# EAGLE schematic Kinefox_3 (EAGLE 9.6.2)
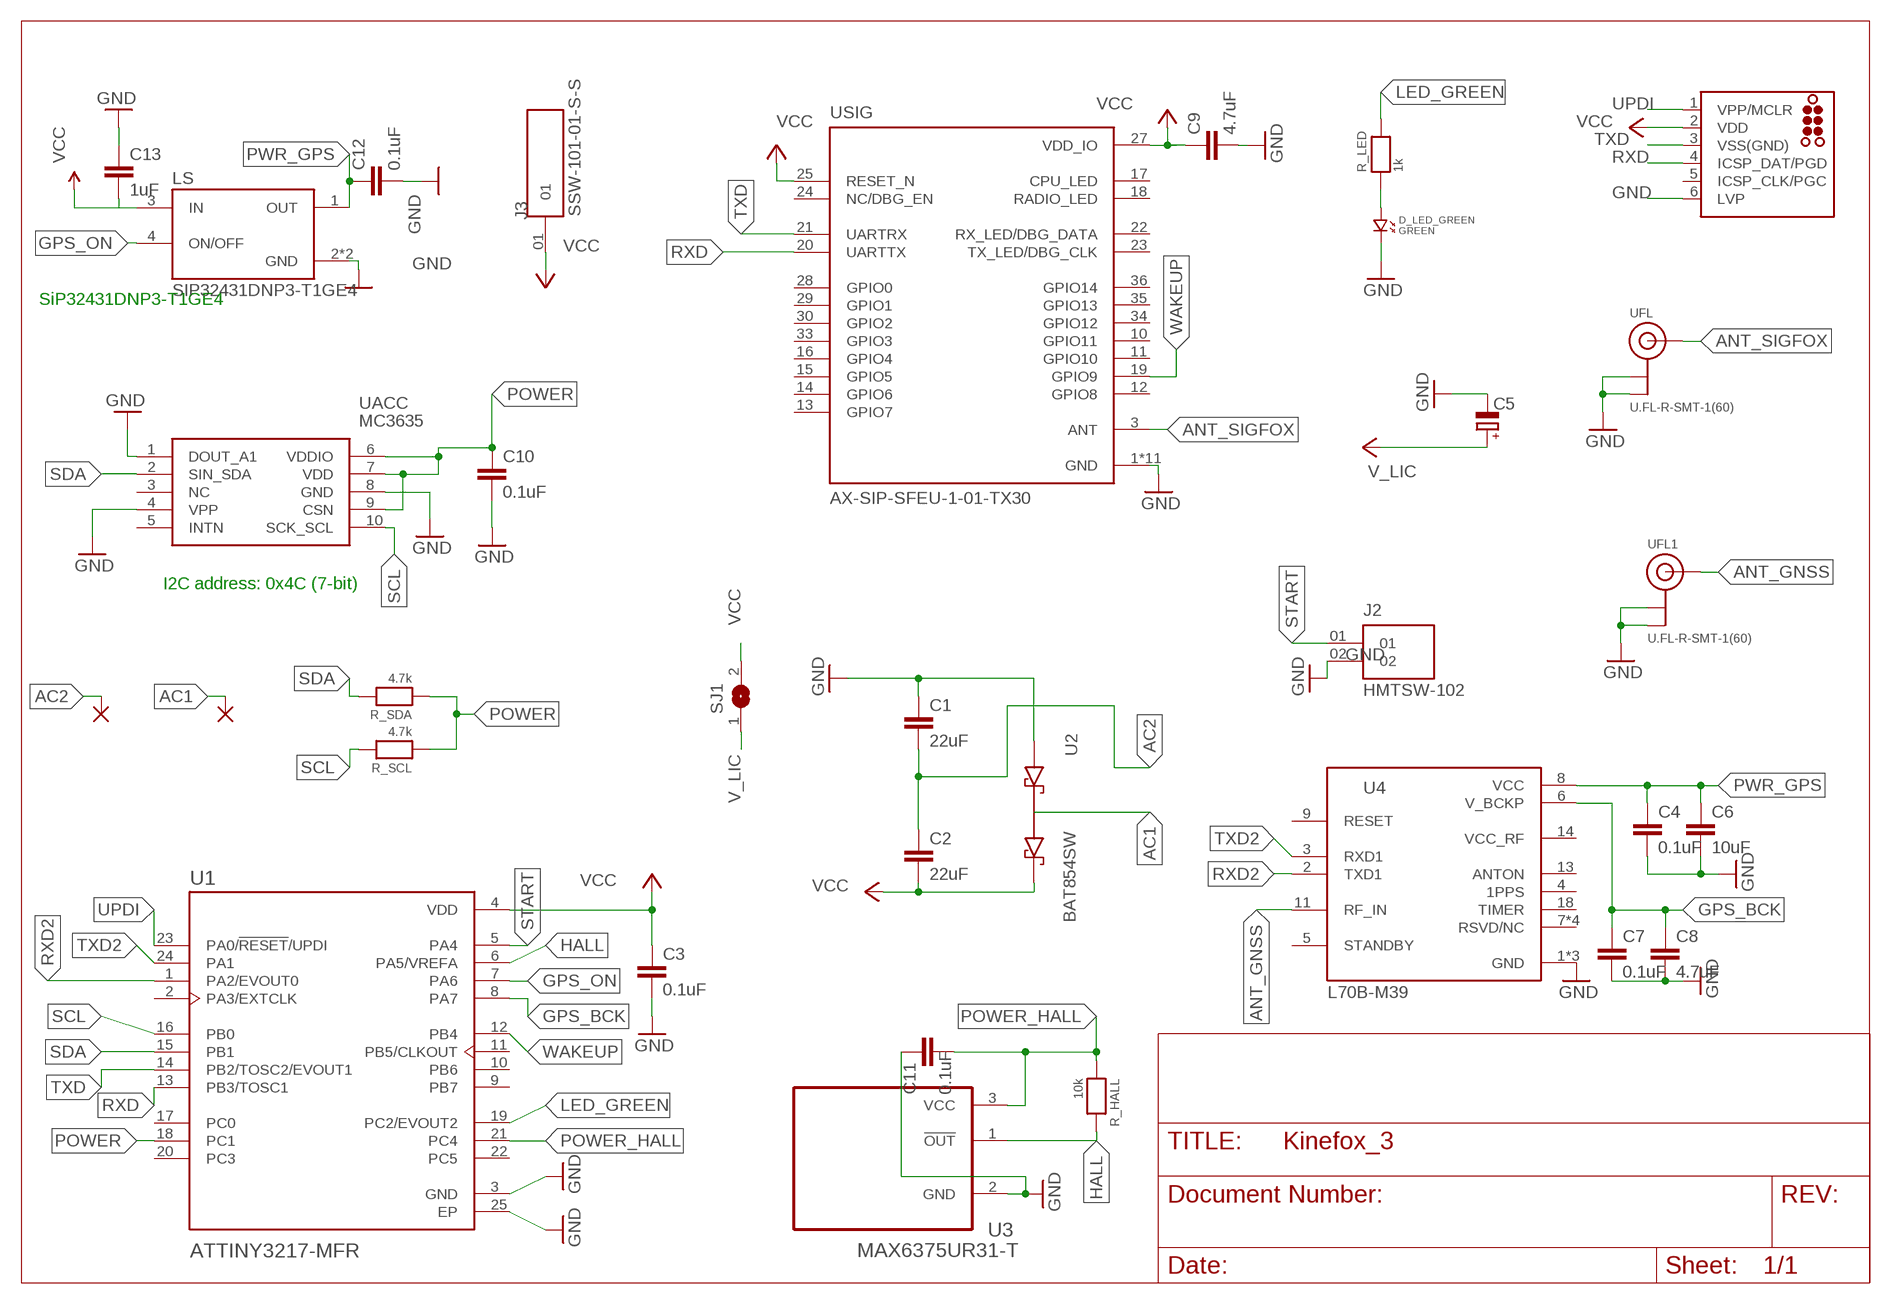
[diagram p0: schematic, sheet 1]

## Parts
C1  22uF  C0402_8PF  [C0402]
C2  22uF  C0402_8PF  [C0402]
C3  0.1uF  C0402_8PF  [C0402]
C4  0.1uF  C0402_8PF  [C0402]
C5  CPOL-EUE3.5-8  [E3,5-8]
C6  10uF  C0402_8PF  [C0402]
C7  0.1uF  C0402_8PF  [C0402]
C8  4.7uF  C0402_8PF  [C0402]
C9  4.7uF  C0402_8PF  [C0402]
C10  0.1uF  C0402_8PF  [C0402]
C11  0.1uF  C0402_8PF  [C0402]
C12  0.1uF  C0402_8PF  [C0402]
C13  1uF  C0402_8PF  [C0402]
D_LED_GREEN  GREEN  CMONR_STANDARDPARTS_LED.0402  [CMONR_STANDARDPARTS_0402.LED]
J1  TC2030-MCP-NL  [TC2030-MCP-NL]
J2  HMTSW-102  HMTSW-102-XX-X-S-XXX  [SAMTEC_HMTSW-102-XX-X-S-XXX]
J3  SSW-101-01-S-S  [SAMTEC_SSW-101-01-S-S]
LS  SIP32431DNP3-T1GE4  [SON50P120X160X60-5N]
PAD1  WIREPAD2,54/1,1  [2,54/1,1]
PAD2  WIREPAD2,54/1,1  [2,54/1,1]
R_HALL  10k  MICROBUILDER_RESISTOR_0402  [MICROBUILDER__0402]
R_LED  1k  MICROBUILDER_RESISTOR_0402  [MICROBUILDER__0402]
R_SCL  4.7k  MICROBUILDER_RESISTOR_0402  [MICROBUILDER__0402]
R_SDA  4.7k  MICROBUILDER_RESISTOR_0402  [MICROBUILDER__0402]
SJ1  SJ  [SJ]
U1  ATTINY3217-MFR  [QFN50P400X400X90-25N]
U2  BAT854SW  [SOT323]
U3  MAX6375UR31-T  [SOT95P237X112-3N]
U4  L70B-M39  [XCVR_L70B-M39]
UACC  MC3635  [MC3635]
UFL  U.FL-R-SMT-1(60)  ANTENNA_U.FL  [U.FL]
UFL1  U.FL-R-SMT-1(60)  ANTENNA_U.FL  [U.FL]
USIG  AX-SIP-SFEU-1-01-TX30  [IC_AX-SIP-SFEU-1-01-TX30]

## Nets
AC1: PAD1.1(P) U2.1(PIN3)
AC2: C1.2 C2.1 PAD2.1(P)
ANT_GNSS: U4.11(RF_IN) UFL1.3(SIGNAL)
ANT_SIGFOX: UFL.3(SIGNAL) USIG.3(ANT)
GND: C1.1 C3.2 C4.2 C5.- C6.2 C7.2 C8.2 C9.2 C10.2 C11.1 C12.2 C13.1 D_LED_GREEN.P$2 J1.6(LVP) J2.02 LS.2(GND) LS.5(GND) U1.3(GND) U1.25(EP) U2.2(PIN1) U3.2(GND) U4.1(GND) U4.10(GND) U4.12(GND) UACC.1(DOUT_A1) UACC.4(VPP) UACC.8(GND) UFL1.1(GND) UFL1.2(GND) UFL.1(GND) UFL.2(GND) USIG.1(GND) USIG.2(GND) USIG.4(GND) USIG.6(GND) USIG.26(GND) USIG.P1(GND) USIG.P2(GND) USIG.P3(GND) USIG.P4(GND) USIG.P5(GND) USIG.P6(GND)
GPS_BCK: C7.1 C8.1 U1.8(PA7) U4.6(V_BCKP)
GPS_ON: LS.4(ON/OFF) U1.7(PA6)
HALL: R_HALL.2 U1.6(PA5/VREFA) U3.1(!OUT)
LED_GREEN: R_LED.2 U1.19(PC2/EVOUT2)
N$1: D_LED_GREEN.P$1 R_LED.1
POWER: C10.1 R_SCL.1 R_SDA.1 U1.18(PC1) UACC.6(VDDIO) UACC.7(VDD) UACC.9(CSN)
POWER_HALL: C11.2 R_HALL.1 U1.21(PC4) U3.3(VCC)
PWR_GPS: C4.1 C6.1 C12.1 LS.1(OUT) U4.8(VCC)
RXD: J1.4(ICSP_DAT/PGD) U1.13(PB3/TOSC1) USIG.20(UARTTX)
RXD2: U1.1(PA2/EVOUT0) U4.2(TXD1)
SCL: R_SCL.2 U1.16(PB0) UACC.10(SCK_SCL)
SDA: R_SDA.2 U1.15(PB1) UACC.2(SIN_SDA)
START: J2.01 U1.5(PA4)
TXD: J1.3(VSS(GND)) U1.14(PB2/TOSC2/EVOUT1) USIG.21(UARTRX)
TXD2: U1.24(PA1) U4.3(RXD1)
UPDI: J1.1(VPP/MCLR) U1.23(PA0/!RESET!/UPDI)
V_LIC: C5.+ SJ1.1 ; supply symbol labelled VCC
VCC: C2.2 C3.1 C9.1 C13.2 J1.2(VDD) J3.01 LS.3(IN) SJ1.2 U1.4(VDD) U2.3(PIN2) USIG.25(RESET_N) USIG.27(VDD_IO) ; supply symbol labelled V_BATT
WAKEUP: U1.12(PB4) USIG.19(GPIO9)
Unconnected: J1.5(ICSP_CLK/PGC) U1.2(PA3/EXTCLK) U1.9(PB7) U1.10(PB6) U1.11(PB5/CLKOUT) U1.17(PC0) U1.20(PC3) U1.22(PC5) U4.4(1PPS) U4.5(STANDBY) U4.7(RSVD/NC) U4.9(RESET) U4.13(ANTON) U4.14(VCC_RF) U4.15(RSVD/NC) U4.16(RSVD/NC) U4.17(RSVD/NC) U4.18(TIMER) UACC.3(NC) UACC.5(INTN) USIG.10(GPIO11) USIG.11(GPIO10) USIG.12(GPIO8) USIG.13(GPIO7) USIG.14(GPIO6) USIG.15(GPIO5) USIG.16(GPIO4) USIG.17(CPU_LED) USIG.18(RADIO_LED) USIG.22(RX_LED/DBG_DATA) USIG.23(TX_LED/DBG_CLK) USIG.24(NC/DBG_EN) USIG.28(GPIO0) USIG.29(GPIO1) USIG.30(GPIO2) USIG.33(GPIO3) USIG.34(GPIO12) USIG.35(GPIO13) USIG.36(GPIO14)

## Notes on the sheet
- SiP32431DNP3-T1GE4
- I2C address: 0x4C (7-bit)

## Library data of the parts
C1-C4 C6-C13 = TSEM:C: Non-polarized capacitor; FARNELL_OC: 2210758; MF: TDK; MPN: CGA2B2C0G1H080D050BA; VALUE: 8pF
C5 = qfm-trx1-24g:CPOL-EU: POLARIZED CAPACITOR, European symbol
D_LED_GREEN = TinyPICO:CMONR_STANDARDPARTS_LED
J1 = tag-connect:TC2030: TAG-CONNECT ICSP Connector Manufacturer: Tag-Connect <http://www.tag-connect.com> Cable for easy In-Circuit Serial Programming. Designed for Microchip ICD2, suitable for many others. Two variants - one "with legs" (for hands-free fit on PCB) and another "without legs" for quick programming. PAD Description 1 MCLR/Vpp 2 Vdd 3 GND 4 PGD (ISPDAT) 5 PGC (ISPCLK) 6 nc (used for LVP) ©2009 ROFA.cz - modified and updated by Robert Darlington ‹rdarlington@gmail.com›
J2 = HMTSW-102-XX-X-S-XXX:HMTSW-102-XX-X-S-XXX: Connector Header Through Hole 2 position 0.100" (2.54mm) Check availability <https://pricing.snapeda.com/parts/HMTSW-102-06-T-S-000/Samtec/view-part?ref=eda>; AVAILABILITY: In Stock; DESCRIPTION: Conn Unshrouded Header HDR 2 POS 2.54mm Solder ST Top Entry Thru-Hole Bulk; MF: Samtec; MP: HMTSW-102-06-T-S-000; PACKAGE: None; PRICE: None; PURCHASE-URL: https://pricing.snapeda.com/search/part/HMTSW-102-06-T-S-000/?ref=eda
J3 = SSW-101-01-S-S:SSW-101-01-S-S: Check availability <https://pricing.snapeda.com/parts/SSW-101-01-S-S/Samtec%20Inc./view-part?ref=eda>; AVAILABILITY: In Stock; DESCRIPTION: 1 Position Receptacle Connector - Through Hole Gold; MF: Samtec Inc.; MP: SSW-101-01-S-S; PACKAGE: None; PRICE: None; PURCHASE-URL: https://pricing.snapeda.com/search/part/SSW-101-01-S-S/?ref=eda
LS = SIP32431DNP3-T1GE4:SIP32431DNP3-T1GE4: Power Switch/Driver 1:1 P-Channel 1.4A 4-TDFN (1.2x1.6) Check prices <https://pricing.snapeda.com/parts/SIP32431DNP3-T1GE4/Vishay%20Siliconix/view-part?ref=eda>; AVAILABILITY: In Stock; DESCRIPTION: Power Switch/Driver 1:1 P-Channel 1.4A 4-TDFN (1.2x1.6); MF: Vishay Siliconix; MP: SIP32431DNP3-T1GE4; PACKAGE: UFDFN-4 Vishay Siliconix; PRICE: None; PURCHASE-URL: https://pricing.snapeda.com/search/part/SIP32431DNP3-T1GE4/?ref=eda
PAD1 PAD2 = wirepad_custom:WIREPAD: Wire PAD connect wire on PCB
R_HALL R_LED R_SCL R_SDA = TinyPICO:MICROBUILDER_RESISTOR: Resistors 0402 - 0402 Surface Mount Package 22 Ohm 1% 1/16W [Digikey: 311-22.0LRTR-ND] 33 Ohm 5% 1/16W 1.0K 5% 1/16W 1.5K 5% 1/16W 2.0K 1% 1/16W 10.0K 1% 1/16W [Digikey: 311-10.0KLRTR-ND] 10.0K 5% 1/16W [Digikey: RMCF0402JT10K0TR-ND] 12.1K 1% 1/16W [Digikey: 311-22.0LRTR-ND] 100.0K 5% 1/16W 0603 - 0603 Surface Mount Package 0 Ohm 1/10 Watt 1% Resistor 15 Ohm 1/10 Watt 1% Resistor 33 Ohm 1/10 Watt 1% Resistor 49.9 Ohm 1/10 Watt 1% Resistor 100 Ohm 1/10 Watt 1% Resistor 150 Ohm 1/10 Watt 1% Resistor 240 Ohm 1/10 Watt 1% Resistor 390 Ohm 1/10 Watt 1% Resistor 560 Ohm 1/10 Watt 1% Resistor 680 Ohm 1/10 Watt 1% Resistor 750 Ohm 1/10 Watt 1% Resistor 1.0K Ohm 1/10 Watt 1% Resistor 1.5K Ohm 1/10 Watt 1% Resistor 2.0K Ohm 1/10 Watt 1% Resistor 2.2K Ohm 1/10 Watt 1% Resistor 3.3K Ohm 1/10 Watt 1% Resistor 4.7K Ohm 1/10 Watt 1% Resistor 10.0K Ohm 1/10 Watt 1% Resistor 12.0K Ohm 1/10 Watt 1% Resistor 12.1K Ohm 1/10 Watt 1% Resistor 20.0K Ohm 1/10 Watt 1% Resistor 33.0K Ohm 1/10 Watt 1% Resistor 100.0K Ohm 1/10 Watt 1% Resistor 0805 - 0805 Surface Mount Package 0 Ohm 1/8 Watt 1% Resistor 33 Ohm 1/8 Watt 1% Resistor 100 Ohm 1/8 Watt 1% Resistor 150 Ohm 1/8 Watt 1% Resistor 200 Ohm 1/8 Watt 1% Resistor 240 Ohm 1/8 Watt 1% Resistor 330 Ohm 1/8 Watt 1% Resistor 390 Ohm 1/8 Watt 1% Resistor 470 Ohm 1/8 Watt 1% Resistor 1.0K Ohm 1/8 Watt 1% Resistor 1.5K Ohm 1/8 Watt 1% Resistor 2.0K Ohm 1/8 Watt 1% Resistor 4.7K Ohm 1/8 Watt 1% Resistor 5.1K Ohm 1/8 Watt 1% Resistor 5.6K Ohm 1/8 Watt 1% Resistor 10.0K Ohm 1/8 Watt 1% Resistor 22.0K Ohm 1/8 Watt 1% Resistor 33.0K Ohm 1/8 Watt 1% Resistor 100K Ohm 1/8 Watt 1% Resistor 1206 - 1206 Surface Mount Package 2012 - 2010 Surface Mount Package 0.11 Ohm 1/2 Watt 1% Resistor - Digikey: RHM.11UCT-ND
SJ1 = jumper:SJ: SMD solder JUMPER
U1 = ATTINY3217-MFR:ATTINY3217-MFR: 20MHZ, 32KB, QFN24, Ind 125C, Green, T&r Check availability <https://pricing.snapeda.com/parts/ATTINY3217-MFR/Microchip/view-part?ref=eda>; AVAILABILITY: In Stock; DESCRIPTION: AVR tinyAVR™ 1, Functional Safety (FuSa) Microcontroller IC 8-Bit 16MHz 32KB (32K x 8) FLASH 24-VQFN (4x4); MF: Microchip; MP: ATTINY3217-MFR; PACKAGE: VFQFN-24 Microchip Technology; PRICE: None; PURCHASE-URL: https://pricing.snapeda.com/search/part/ATTINY3217-MFR/?ref=eda
U2 = BAT854SW:BAT854SW: BAT854W series Schottky barrier (double) diodes source: http://www.nxp.com/documents/data_sheet/BAT854W_SERIES.pdf Check prices <https://pricing.snapeda.com/parts/BAT854SW/NXP%20Semiconductors/view-part?ref=eda>; AVAILABILITY: Bad; DESCRIPTION: Diode Array 1 Pair Series Connection Schottky 40V 200mA (DC) Surface Mount SC-70, SOT-323; MF: NXP Semiconductors; MP: BAT854SW; PACKAGE: None; PRICE: None
U3 = MAX6375UR31-T:MAX6375UR31-T: Check availability <https://pricing.snapeda.com/parts/MAX6375UR31/Maxim%20Integrated/view-part?ref=eda>; AVAILABILITY: In Stock; DESCRIPTION: IC SUPERVISOR UL LO PWR VOLT DET; MF: Maxim Integrated; MP: MAX6375UR31; PACKAGE: SOT-23-3 Maxim Integrated; PRICE: None; PURCHASE-URL: https://pricing.snapeda.com/search/part/MAX6375UR31/?ref=eda
U4 = L70B-M39:L70B-M39: GPS Module Check prices <https://pricing.snapeda.com/parts/L70B-M39/Quectel/view-part?ref=eda> Check prices <https://pricing.snapeda.com/parts/L70B-M39/Quectel/view-part?ref=eda> Check availability <https://pricing.snapeda.com/parts/L70B-M39/Quectel/view-part?ref=eda>; AVAILABILITY: In Stock; DESCRIPTION: L70, an SMD type module, brings the high performance of MTK positioning engine to the industrial applications with compact profile, ultra low power consumption and fast positioning capability.; MF: Quectel; MP: L70B-M39; PACKAGE: None; PRICE: None; PURCHASE-URL: https://pricing.snapeda.com/search/part/L70B-M39/?ref=eda
UACC = MC3635:MC3635: Accelerometers Digital Output 3 Axis Acceleronmeter Source: Datasheet <http://www.mcubemems.com/wp-content/uploads/2017/09/MC3635-Datasheet-APS-048-0044v1.5.pdf>; ARROW_PART_NUMBER: MC3635; ARROW_PRICE-STOCK: https://www.arrow.com/en/products/mc3635/mcube-inc; DESCRIPTION: Accelerometers Digital Output 3 Axis Acceleronmeter; HEIGHT: 0.94mm; MANUFACTURER_NAME: mCube; MANUFACTURER_PART_NUMBER: MC3635; MOUSER_PART_NUMBER: 498-MC3635; MOUSER_PRICE-STOCK: https://www.mouser.co.uk/ProductDetail/mCube/MC3635?qs=xIT89idmjZlQ0wKEjJ43VQ%3D%3D
UFL UFL1 = UFL:ANTENNA_U.FL: U.FL Antenna Connector
USIG = AX-SIP-SFEU-1-01-TX30-V2:AX-SIP-SFEU-1-01-TX30: RF-MICROCONTROLLER, ULTRA Check prices <https://pricing.snapeda.com/parts/AX-SIP-SFEU-1-01-TX30/ON%20Semiconductor/view-part?ref=eda>; AVAILABILITY: In Stock; DESCRIPTION: Sigfox Transceiver Module 868.13MHz, 869.525MHz Antenna Not Included Surface Mount; MF: ON Semiconductor; MP: AX-SIP-SFEU-1-01-TX30; PACKAGE: SIP-38 ON Semiconductor; PRICE: None